# Altium schematic sheet Zynq Config.SchDoc
size Tabloid; ApprovedBy: NA
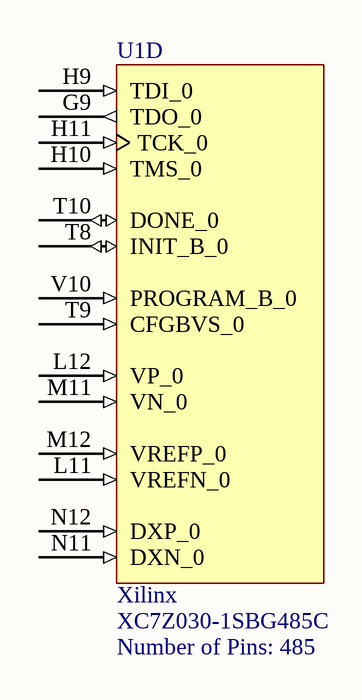
[diagram p0: Zynq Config.SchDoc]

## Parts
U1  Manufacturer: Xilinx  Manufacturer Part Number: XC7Z030-1SBG485C  Number of Pins: 485  [SBG484]  (hidden comment: U_XNLX-XC7Z030-1SBG485C)  (part D of 10)

## Nets

Not connected (* = marked no-connect by the designer): U1 G9(TDO_0) H9(TDI_0) H10(TMS_0) H11(TCK_0) L11(VREFN_0) L12(VP_0) M11(VN_0) M12(VREFP_0) N11(DXN_0) N12(DXP_0) T8(INIT_B_0) T9(CFGBVS_0) T10(DONE_0) V10(PROGRAM_B_0)

## Notes on the sheet
- Project:
- http://www.cospandesign.com
- Cospan Design
- Document:
- Engineer:
- Title:
- Client:
- Approved By:
- Revision:
- Date:
- Number:
- of

## Library data of the parts
U1 = U_XNLX-XC7Z030-1SBG485C: MPU Zynq-7000 RISC 32-Bit 667MHz 1.5V/2V/2.5V 485-Pin FBGA; Speed Grade: -1; RAM Size: 256KB; Number of I/Os: 130; Interface: I2C,SPI,USB,CAN,Ethernet,MMC,SDIO,SD,UART,USART,EBI/EMI; Data Bus Width: 32b; Peripherals: DMA; Supplier 1: Digikey; Stock 1: 102; Pricing 1: 1=230.1 (USD); Case/Package: FBGA; Contact Plating: Copper,Tin,Silver; Min Operating Temperature: 0°C; Max Operating Temperature: 85°C; Packaging: Tray; Frequency: 667MHz; Max Frequency: 667MHz; ComponentLink1URL: https://datasheet.ciiva.com/48476/ds190-zynq-7000-overview-48476904.pdf; ComponentLink1Description: https://datasheet.ciiva.com/48476/ds190-zynq-7000-overview-48476904.pdf; Supplier Part Number 1: 122-1924-ND